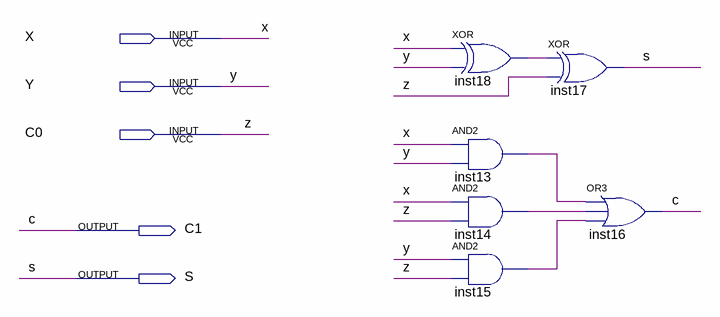
[diagram p0: schematic sheet]
// Quartus schematic full-adder.bdf as structural Verilog: 6 symbols, 5 pins
module \full-adder  (
  input  X,
  input  Y,
  input  C0,
  output C1,
  output S
);

  wire inst13_out, inst14_out, inst15_out, inst18_out;

  xor inst18 (inst18_out, X, Y);
  and inst13 (inst13_out, X, Y);
  and inst14 (inst14_out, X, C0);
  and inst15 (inst15_out, Y, C0);
  xor inst17 (S, inst18_out, C0);
  or inst16 (C1, inst13_out, inst14_out, inst15_out);

  // Other names for the same wires on the sheet: c = C1; z = C0
endmodule
